# EAGLE design csxcad (EAGLE 6.5.0)
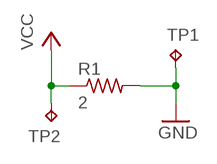
[diagram p0: schematic, sheet 1]

## Parts
R1  2  R-US_R0603  [R0603]
TP1  TPB2,54  [B2,54]
TP2  TPB2,54  [B2,54]

## Nets
GND: R1.2 TP1.TP
VCC: R1.1 TP2.TP

## Library data of the parts
R1 = resistor:R-US_: RESISTOR, American symbol
TP1 TP2 = testpad:TP: Test pad

## Board
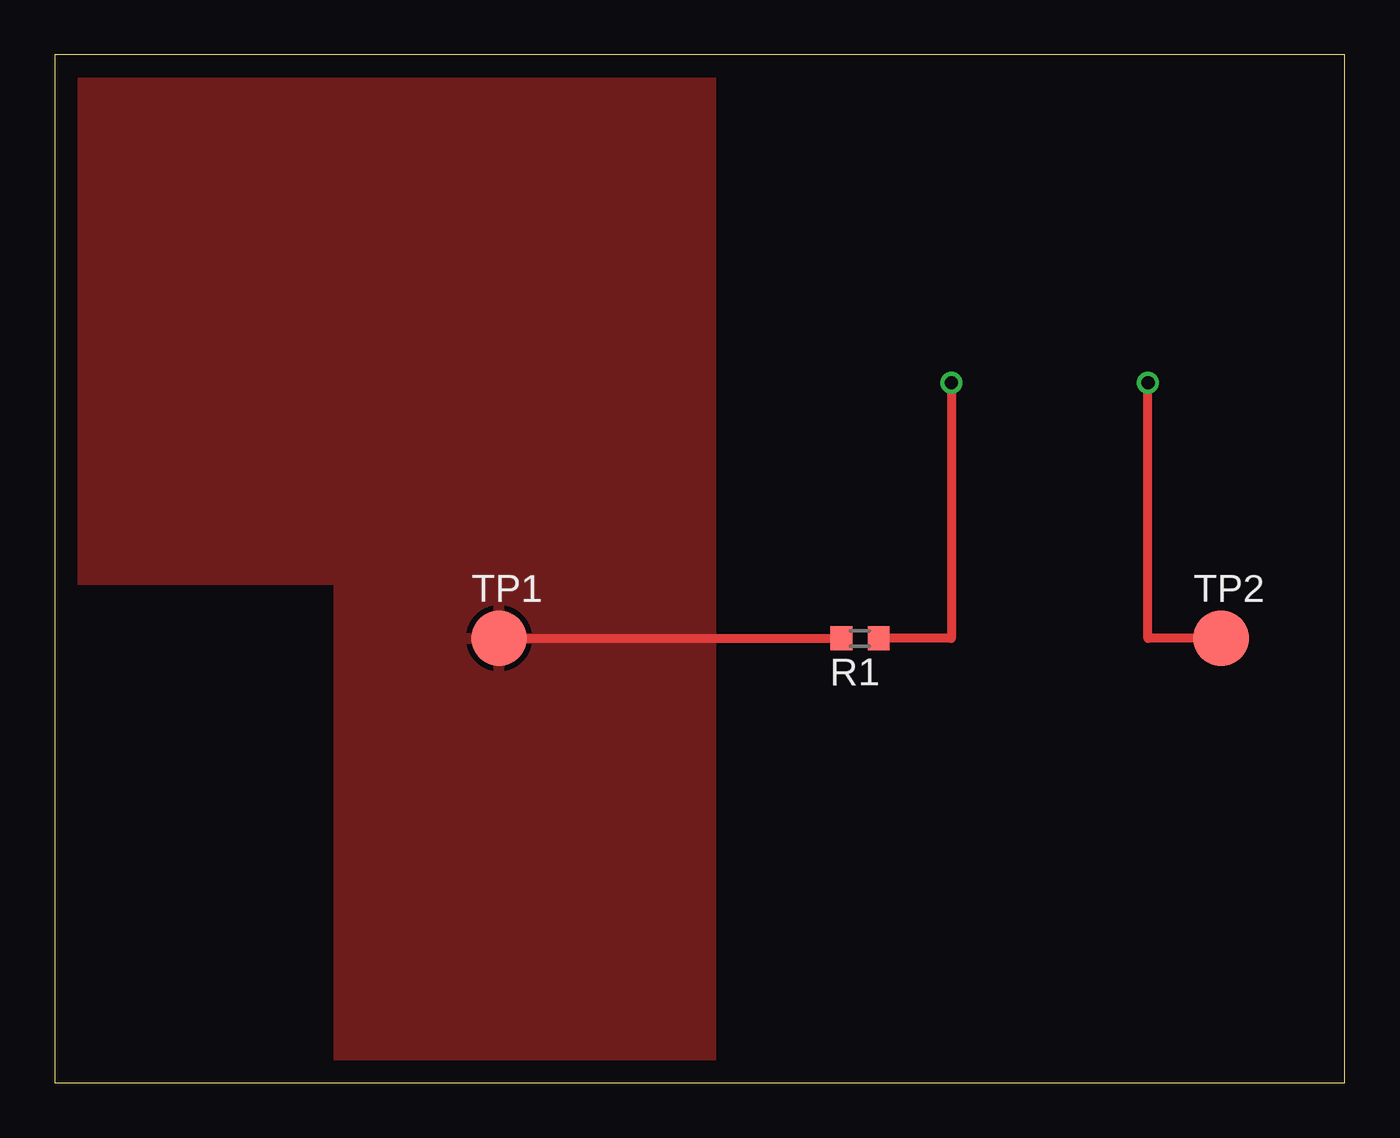
[diagram p1: board, top side]
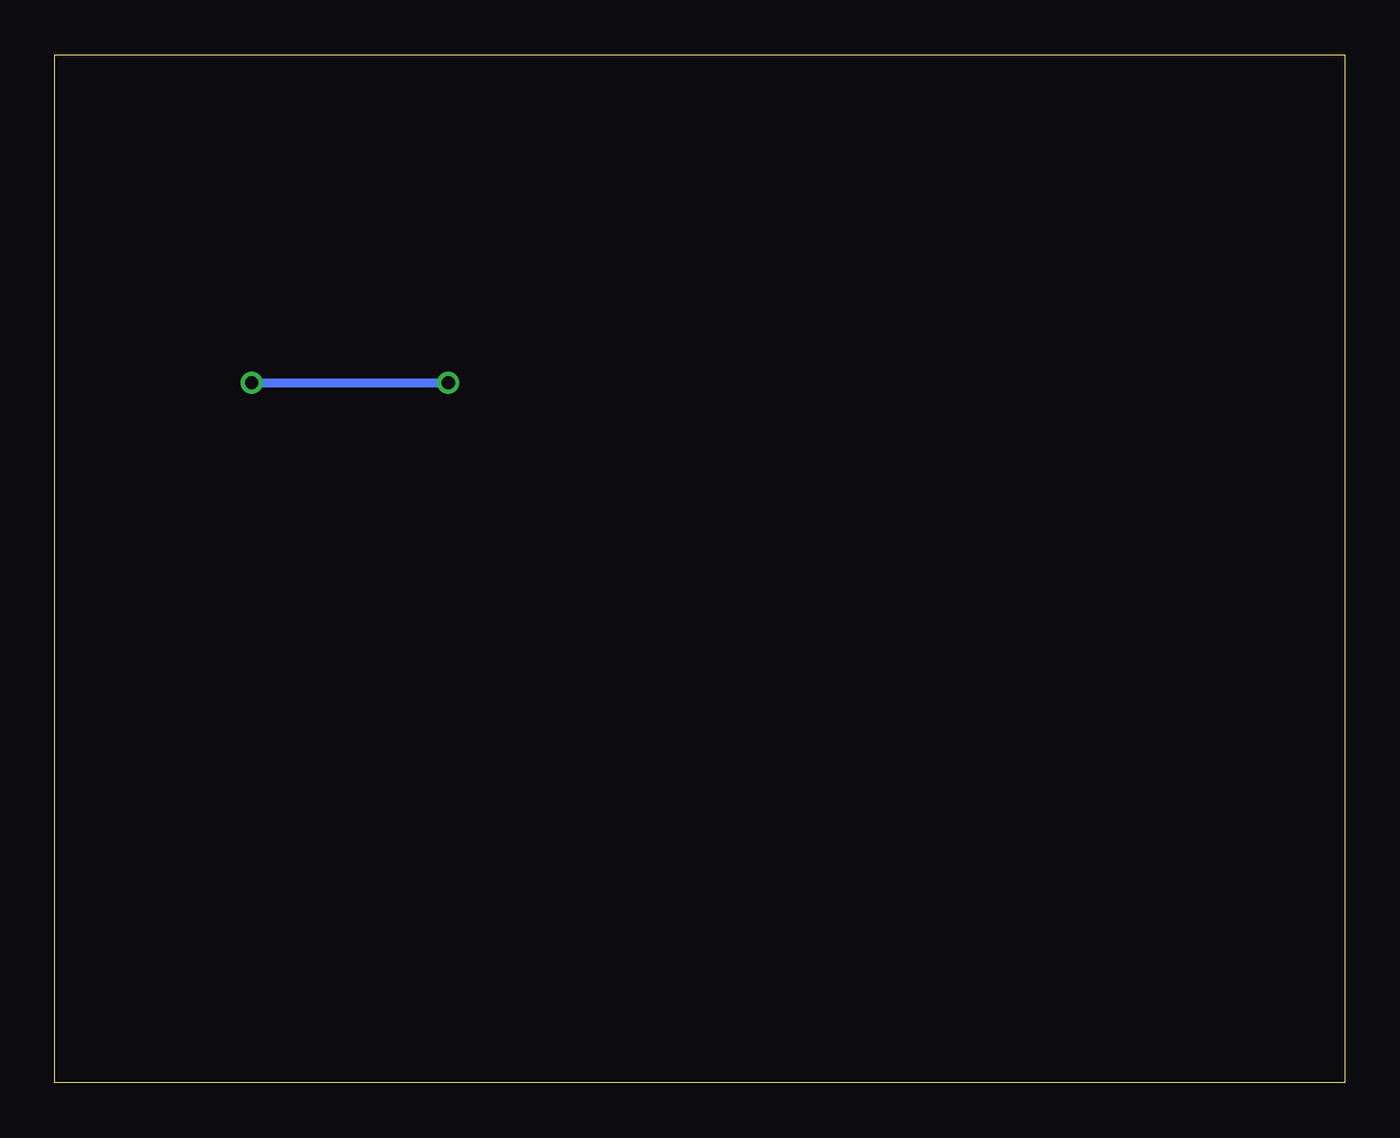
[diagram p2: board, bottom side, seen from below]

Size 59 x 47 mm. Coordinates in mm from the lower left corner, seen from the top.
Outline: 0,0 59,0 59,47 0,47 0,0
Copper layers (1*16): Top 0.035mm / dielectric 1.5mm / Bottom 0.035mm
Design rules "default": minimum track width 10mil, minimum drill 24mil, track to track 8mil, track to pad 8mil, pad to pad 8mil, via to via 8mil, smd to smd 8mil, copper to edge 40mil, drill to drill 8mil, minimum pad ring 10mil, minimum via ring 8mil, stop-mask expansion 4mil, vias tented up to drill 0mil, thermal gap 10mil

### Footprints (pad centres in the part's own frame; a part is rotated, then mirrored left to right if it is on the bottom)
R0603 = smd 1 x 1.1: 1 -0.85,0; 2 0.85,0
B2,54 = smd 2.54 x 2.54: TP 0,0

### Placement (x,y rotation side)
R1  36.83,20.32 180 top
TP1  20.32,20.32 0 top
TP2  53.34,20.32 0 top

### Tracks (layer width: path | path; a pad name or v marks a point on that pad's centre or on a via)
GND
  Top 0.406: TP1.TP R1.2
  pour Top: 1,46 30,46 30,1 13,1 13,23 1,23
VCC  (via drill 0.6)
  Top 0.406: TP2.TP 50,20.32 v50,32 | v41,32 41,20.32 R1.1
  Bottom 0.406: v50,32 v41,32